# EAGLE design Slave (EAGLE 7.5.0)
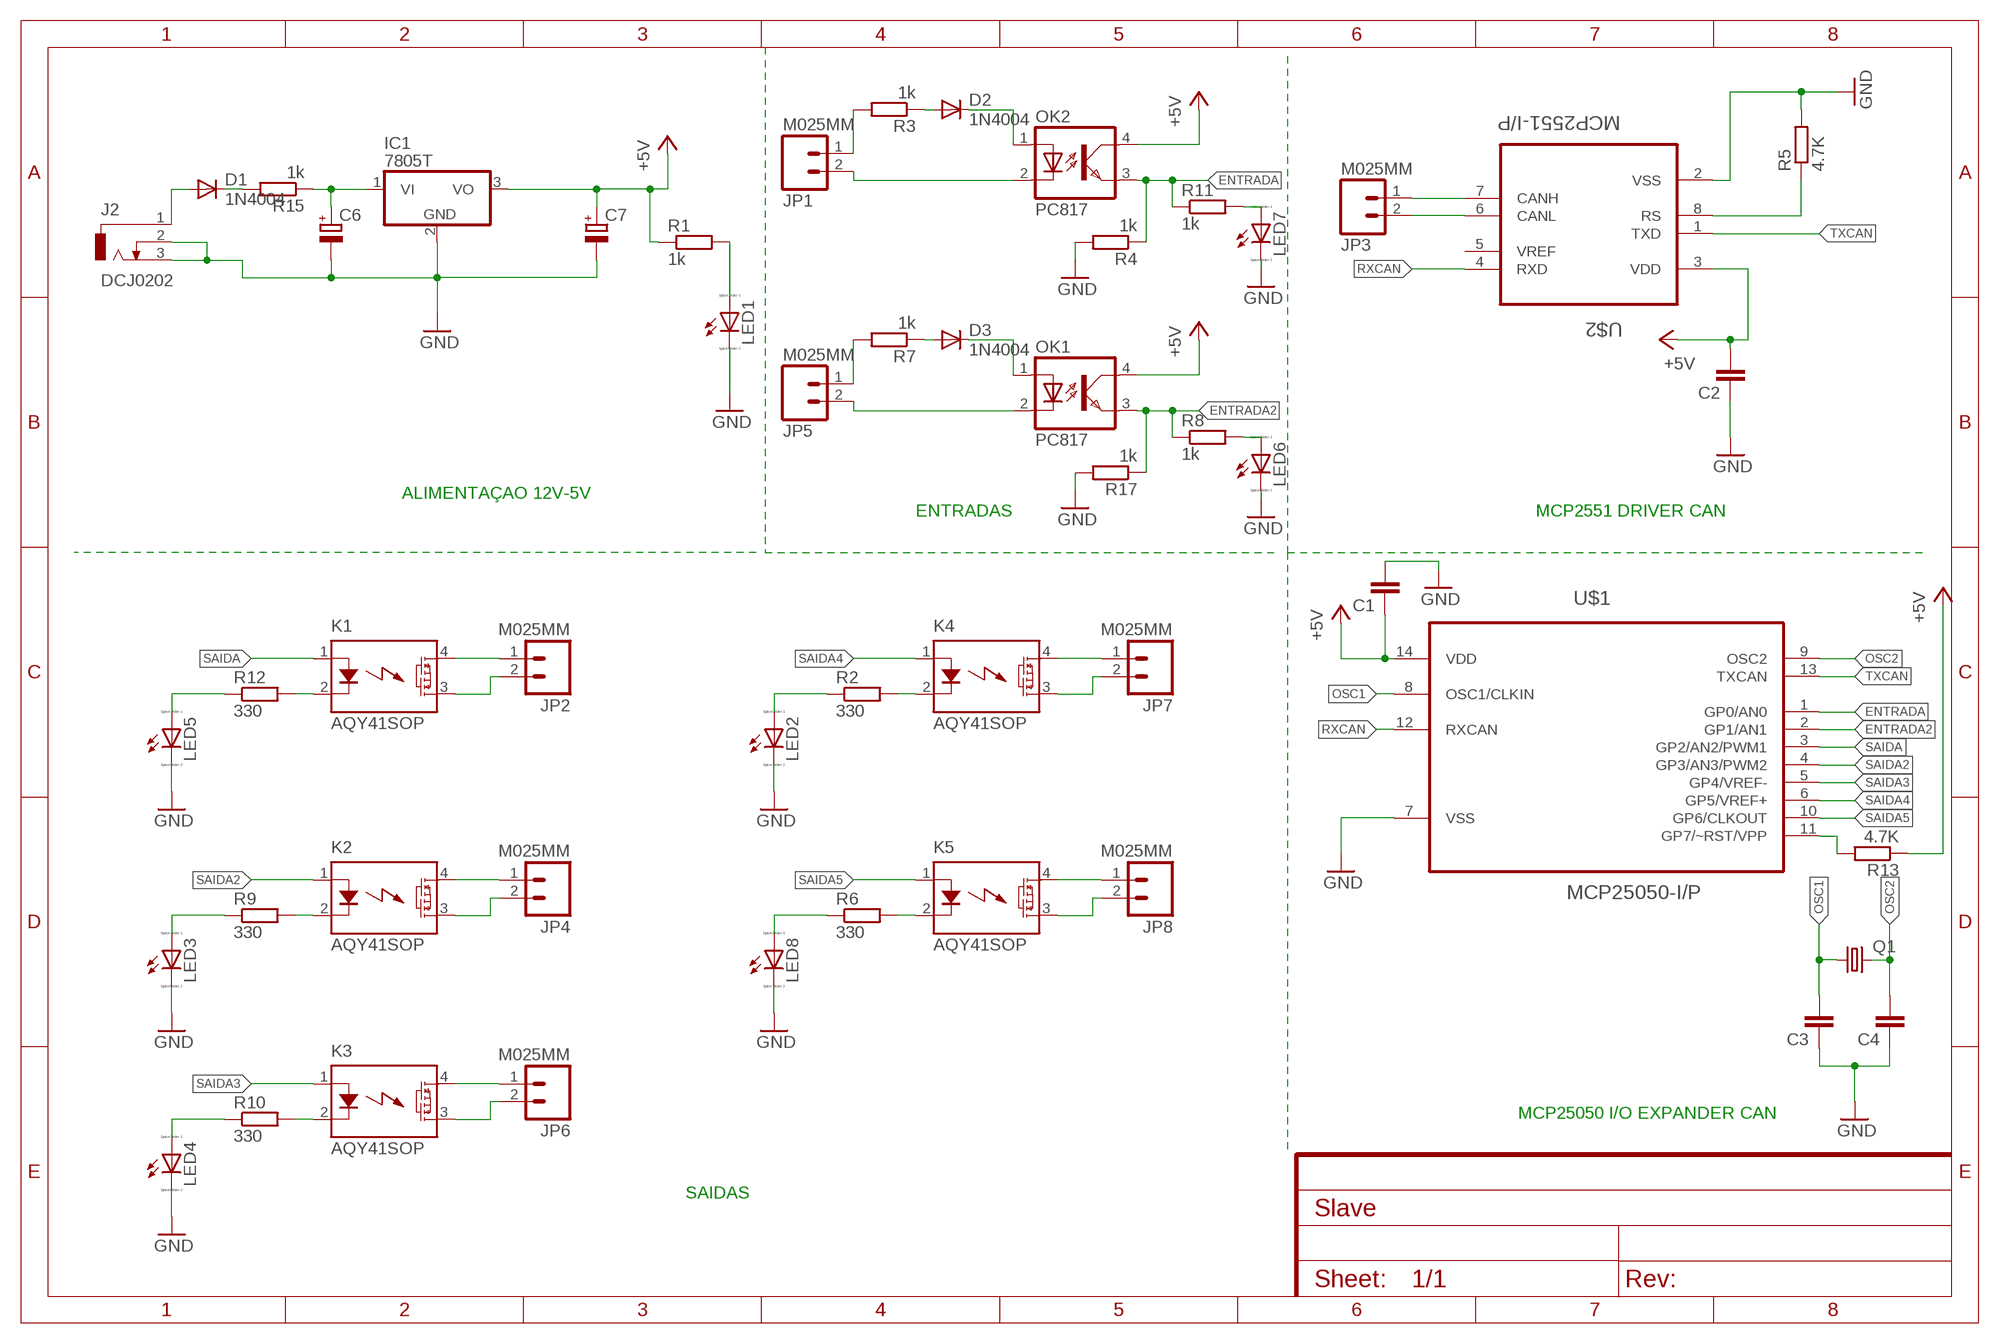
[diagram p0: schematic, sheet 1]

## Parts
C1  C-EU025-025X050  [C025-025X050]
C2  C-EU025-025X050  [C025-025X050]
C3  CAP_  [AXIAL-5MM]
C4  CAP_  [AXIAL-5MM]
C6  CPOL-EUE2.5-6  [E2,5-6]
C7  CPOL-EUE2.5-6  [E2,5-6]
D1  1N4004  [DO41-10]
D2  1N4004  [DO41-10]
D3  1N4004  [DO41-10]
IC1  7805T  [TO220H]
J2  DCJ0202  [DCJ0202]
JP1  M025MM  [SCREWTERMINAL-5MM-2]
JP2  M025MM  [SCREWTERMINAL-5MM-2]
JP3  M025MM  [SCREWTERMINAL-5MM-2]
JP4  M025MM  [SCREWTERMINAL-5MM-2]
JP5  M025MM  [SCREWTERMINAL-5MM-2]
JP6  M025MM  [SCREWTERMINAL-5MM-2]
JP7  M025MM  [SCREWTERMINAL-5MM-2]
JP8  M025MM  [SCREWTERMINAL-5MM-2]
K1  AQY41SOP  [SOP04]
K2  AQY41SOP  [SOP04]
K3  AQY41SOP  [SOP04]
K4  AQY41SOP  [SOP04]
K5  AQY41SOP  [SOP04]
LED1  LED_ELD260  [LED_LD260]
LED2  LED_ELD260  [LED_LD260]
LED3  LED_ELD260  [LED_LD260]
LED4  LED_ELD260  [LED_LD260]
LED5  LED_ELD260  [LED_LD260]
LED6  LED_ELD260  [LED_LD260]
LED7  LED_ELD260  [LED_LD260]
LED8  LED_ELD260  [LED_LD260]
OK1  PC817  [DIL04]
OK2  PC817  [DIL04]
Q1  CRYTALHC49S  [HC49/S]
R1  1k  R-EU_0204/7  [0204/7]
R2  330  R-EU_0204/7  [0204/7]
R3  1k  R-EU_0204/7  [0204/7]
R4  1k  R-EU_0204/7  [0204/7]
R5  4.7K  R-EU_0204/7  [0204/7]
R6  330  R-EU_0204/7  [0204/7]
R7  1k  R-EU_0204/7  [0204/7]
R8  1k  R-EU_0204/7  [0204/7]
R9  330  R-EU_0204/7  [0204/7]
R10  330  R-EU_0204/7  [0204/7]
R11  1k  R-EU_0204/7  [0204/7]
R12  330  R-EU_0204/7  [0204/7]
R13  4.7K  R-EU_0204/7  [0204/7]
R15  1k  R-EU_0204/7  [0204/7]
R17  1k  R-EU_0204/7  [0204/7]
U$1  MCP25050-I/P  [DIP254P762X432-14]
U$2  MCP2551-I/P  [DIP254P762X432-8]

## Nets
+5V: C1.1 C2.2 C7.+ IC1.3(VO) OK1.4(COL) OK2.4(COL) R1.1 R13.1 U$1.14(VDD) U$2.3(VDD)
ENTRADA: OK2.3(EMIT) R4.1 R11.1 U$1.1(GP0/AN0)
ENTRADA2: OK1.3(EMIT) R8.1 R17.1 U$1.2(GP1/AN1)
GND: C1.2 C2.1 C3.P$1 C4.P$1 C6.- C7.- IC1.2(GND) J2.2 J2.3 LED1.K(C) LED2.K(C) LED3.K(C) LED4.K(C) LED5.K(C) LED6.K(C) LED7.K(C) LED8.K(C) R4.2 R5.2 R17.2 U$1.7(VSS) U$2.2(VSS)
N$2: R5.1 U$2.8(RS)
N$3: JP2.2 K1.3(DS2)
N$4: JP2.1 K1.4(DS1)
N$5: K2.2(K) R9.2
N$6: JP1.1 R3.2
N$7: LED1.A R1.2
N$8: R13.2 U$1.11(GP7/~RST/VPP)
N$9: D2.A R3.1
N$10: D2.C OK2.1(A)
N$11: JP1.2 OK2.2(C)
N$13: D1.A J2.1
N$14: JP5.1 R7.2
N$15: D1.C R15.2
N$17: D3.A R7.1
N$18: D3.C OK1.1(A)
N$19: JP3.1 U$2.7(CANH)
N$20: LED3.A R9.1
N$21: JP4.2 K2.3(DS2)
N$22: JP4.1 K2.4(DS1)
N$23: K1.2(K) R12.2
N$24: LED5.A R12.1
N$25: K3.2(K) R10.2
N$26: LED4.A R10.1
N$27: JP6.2 K3.3(DS2)
N$28: JP6.1 K3.4(DS1)
N$29: C6.+ IC1.1(VI) R15.1
N$30: JP3.2 U$2.6(CANL)
N$31: LED6.A R8.2
N$32: LED7.A R11.2
N$33: K4.2(K) R2.2
N$34: JP5.2 OK1.2(C)
N$35: LED2.A R2.1
N$36: JP7.2 K4.3(DS2)
N$37: JP7.1 K4.4(DS1)
N$38: K5.2(K) R6.2
N$39: LED8.A R6.1
N$40: JP8.2 K5.3(DS2)
N$41: JP8.1 K5.4(DS1)
OSC1: C3.P$2 Q1.1 U$1.8(OSC1/CLKIN)
OSC2: C4.P$2 Q1.2 U$1.9(OSC2)
RXCAN: U$1.12(RXCAN) U$2.4(RXD)
SAIDA: K1.1(A) U$1.3(GP2/AN2/PWM1)
SAIDA2: K2.1(A) U$1.4(GP3/AN3/PWM2)
SAIDA3: K3.1(A) U$1.5(GP4/VREF-)
SAIDA4: K4.1(A) U$1.6(GP5/VREF+)
SAIDA5: K5.1(A) U$1.10(GP6/CLKOUT)
TXCAN: U$1.13(TXCAN) U$2.1(TXD)
Unconnected: U$2.5(VREF)

## Notes on the sheet
- ALIMENTAÇAO 12V-5V
- ENTRADAS | MCP2551 DRIVER CAN
- MCP25050 I/O EXPANDER CAN
- SAIDAS

## Library data of the parts
C1 C2 = rcl:C-EU: CAPACITOR, European symbol
C3 C4 = SparkFun-Capacitors:CAP: Capacitor Standard 0603 ceramic capacitor, and 0.1" leaded capacitor.
C6 C7 = resistor:CPOL-EU: POLARIZED CAPACITOR, European symbol
D1-D3 = adafruit:1N4004: DIODE General purpose 1N400x type rectifier (With bigger pads) http://www.ladyada.net/library/pcb/eaglelibrary.html
IC1 = linear:78*: Positive VOLTAGE REGULATOR Source: http://cache.national.com/ds/LM/LM78L05.pdf http://www.fairchildsemi.com/ds/LM/LM7805.pdf
J2 = con-jack:DCJ0202: DC POWER JACK Source: DCJ0202.pdf; OC_FARNELL: unknown; OC_NEWARK: unknown
JP1-JP8 = SparkFun-Connectors:M02: Standard 2-pin 0.1" header. Use with - straight break away headers ( PRT-00116) - right angle break away headers (PRT-00553) - swiss pins (PRT-00743) - machine pins (PRT-00117) - female headers (PRT-00115) Molex polarized connector foot print use with: PRT-08233 with associated crimp pins and housings. 2.54_SCREWTERM for use with PRT-10571. 3.5mm Screw Terminal footprints for PRT-08084 5mm Screw Terminal footprints for use with PRT-08433
K1-K5 = relay:AQY*: PhotoMOS Relay NAiS Source: http://www.panasonic-electric-works.com/catalogues/downloads/photomos/ds_x615_en_aqz10_20.pdf; OC_FARNELL: unknown; OC_NEWARK: unknown
LED1-LED8 = eagle-ltspice:LED_E: LED Source: http://www.osram.convergy.de Source: www.luxeon.com Source: www.kingbright.com; SPICEMODEL: NONE; SPICEPREFIX: D; SPICETYPE: diode
OK1 OK2 = optocoupler:PC817: SHARP OPTO COUPLER; MPN: PC817X4J000F; OC_FARNELL: 9707727; OC_NEWARK: 97K7059
Q1 = crystal:CRYTAL: CRYSTAL
R1-R13 R15 R17 = resistor:R-EU_: RESISTOR, European symbol
U$1 = Microchip_By_element14_Batch_1:MCP25050-I/P: CAN I/O Expander Family; MPN: MCP25050-I/P; OC_FARNELL: 1439736; OC_NEWARK: 59K0224; PACKAGE: DIP-14; SUPPLIER: Microchip
U$2 = Microchip_By_element14_Batch_1:MCP2551-I/P: High-Speed CAN Transceiver; DESCRIPTION: CAN CTRL; MPN: MCP2551-I/P; OC_FARNELL: 1292240; OC_NEWARK: 61K2947; PACKAGE: PDIP-8; SUPPLIER: Microchip

## Board
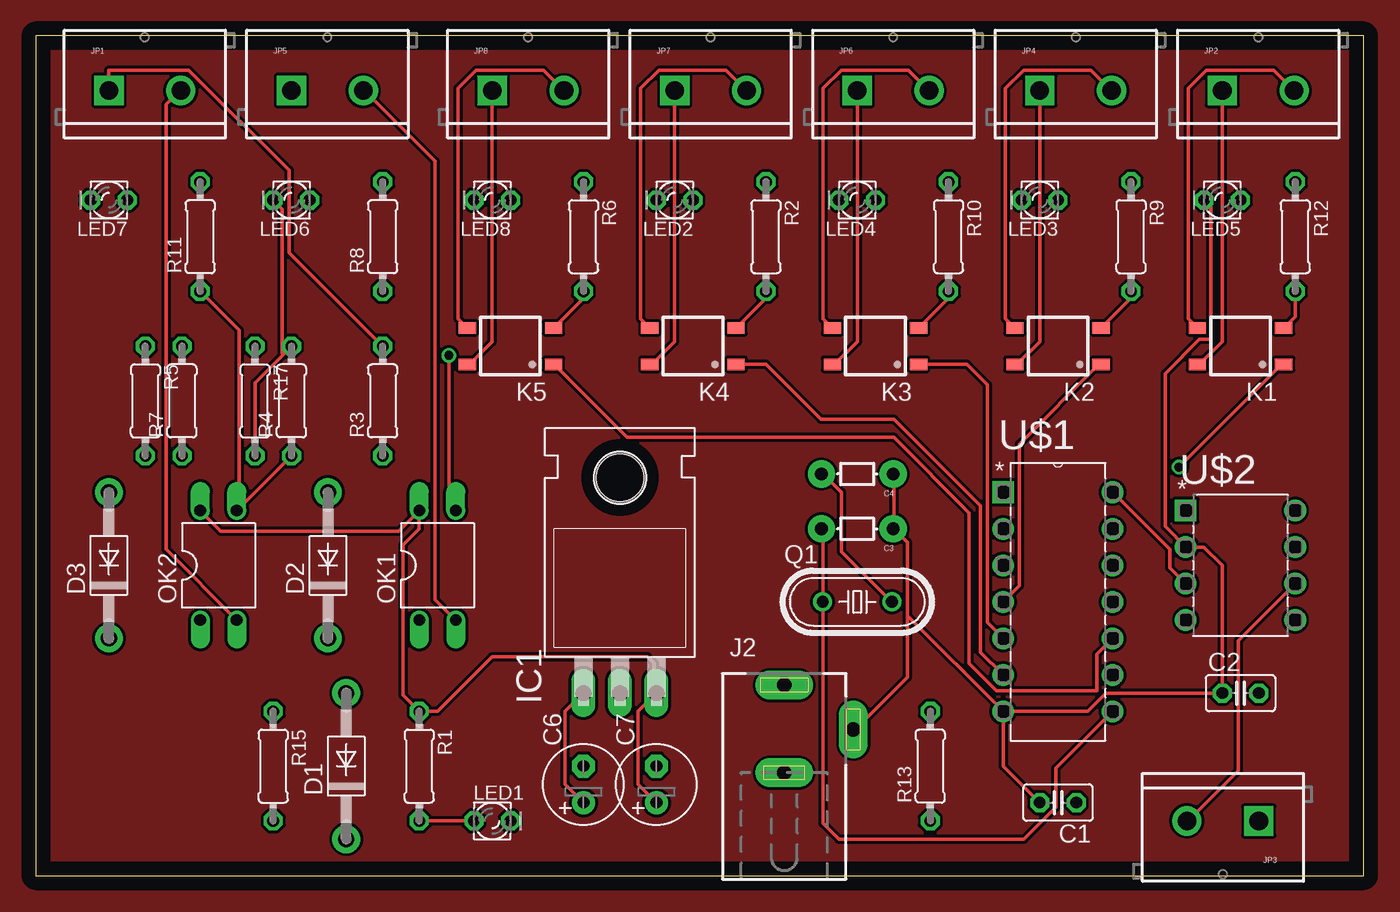
[diagram p1: board, top side]
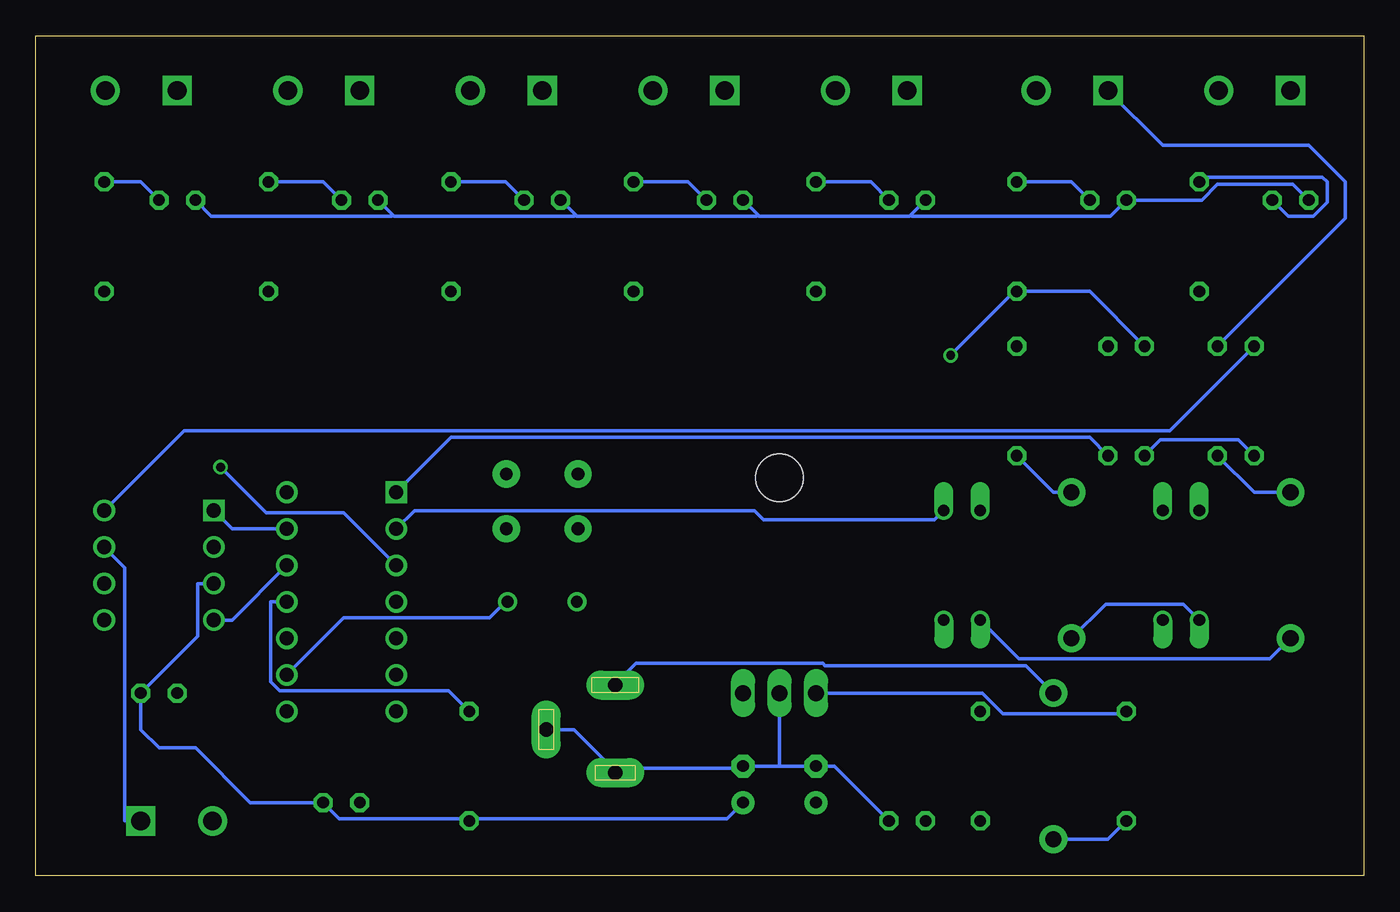
[diagram p2: board, bottom side, seen from below]

Size 92.38 x 58.41 mm. Coordinates in mm from the lower left corner, seen from the top.
Outline: 0,0 92.38,0 92.38,58.41 0,58.41 0,0
Copper layers (1*16): Top 0.035mm / dielectric 1.5mm / Bottom 0.035mm
Design rules "default": minimum track width 10mil, minimum drill 24mil, track to track 8mil, track to pad 8mil, pad to pad 8mil, via to via 8mil, smd to smd 8mil, copper to edge 40mil, drill to drill 8mil, minimum pad ring 10mil, minimum via ring 8mil, stop-mask expansion 4mil, vias tented up to drill 0mil, thermal gap 10mil

### Footprints (pad centres in the part's own frame; a part is rotated, then mirrored left to right if it is on the bottom)
C025-025X050 = drill 0.813 octagon: 1 -1.27,0; 2 1.27,0
AXIAL-5MM = drill 0.9 pad 1.88: P$1 -2.5,0; P$2 2.5,0
E2,5-6 = drill 0.813 pad 1.6: + -1.27,0 | drill 0.813 pad 1.6 octagon: - 1.27,0
DO41-10 = drill 1.118 pad 1.93: A 5.08,0; C -5.08,0
TO220H = drill 1.118 long: 1 -2.54,-10.16; 2 0,-10.16; 3 2.54,-10.16 | hole 3.302: 0,4.826
DCJ0202 = drill 1 pad 2 long: 1 0,3.1; 2 4.8,0; 3 0,-3
SCREWTERMINAL-5MM-2 = drill 1.3 pad 2.032 square: 1 0,0 | drill 1.3 pad 2.032: 2 5,0
SOP04 = smd 0.8 x 1.2: 1 -1.27,-3; 2 1.27,-3; 3 1.27,3; 4 -1.27,3
LED_LD260 = drill 0.813 octagon: A -1.27,0; K 1.27,0
DIL04 = drill 0.813 offset: 1 -1.27,-3.81; 2 1.27,-3.81; 3 1.27,3.81; 4 -1.27,3.81
HC49/S = drill 0.813: 1 -2.413,0; 2 2.413,0
0204/7 = drill 0.813 octagon: 1 -3.81,0; 2 3.81,0
DIP254P762X432-14 = drill 0.991 square: 1 -7.62,15.24 | drill 0.991: 2 -7.62,12.7; 3 -7.62,10.16; 4 -7.62,7.62; 5 -7.62,5.08; 6 -7.62,2.54; 7 -7.62,0; 8 0,0; 9 0,2.54; 10 0,5.08; 11 0,7.62; 12 0,10.16; 13 0,12.7; 14 0,15.24
DIP254P762X432-8 = drill 0.991 square: 1 -7.62,7.62 | drill 0.991: 2 -7.62,5.08; 3 -7.62,2.54; 4 -7.62,0; 5 0,0; 6 0,2.54; 7 0,5.08; 8 0,7.62

### Placement (x,y rotation side)
C1  71.12,5.08 180 top
C2  83.82,12.7 0 top
C3  57.15,24.13 180 top
C4  57.15,27.94 180 top
C6  38.1,6.35 90 top
C7  43.18,6.35 90 top
D1  21.59,7.62 90 top
D2  20.32,21.59 90 top
D3  5.08,21.59 90 top
IC1  40.64,22.86 0 top
J2  52.07,10.16 0 top
JP1  5.08,54.61 0 top
JP2  82.55,54.61 0 top
JP3  85.09,3.81 180 top
JP4  69.85,54.61 0 top
JP5  17.78,54.61 0 top
JP6  57.15,54.61 0 top
JP7  44.45,54.61 0 top
JP8  31.75,54.61 0 top
K1  83.82,36.83 90 top
K2  71.12,36.83 90 top
K3  58.42,36.83 90 top
K4  45.72,36.83 90 top
K5  33.02,36.83 90 top
LED1  31.75,3.81 0 top
LED2  44.45,46.99 180 top
LED3  69.85,46.99 180 top
LED4  57.15,46.99 180 top
LED5  82.55,46.99 180 top
LED6  17.78,46.99 180 top
LED7  5.08,46.99 180 top
LED8  31.75,46.99 180 top
OK1  27.94,21.59 0 top
OK2  12.7,21.59 0 top
Q1  57.15,19.05 0 top
R1  26.67,7.62 270 top
R2  50.8,44.45 270 top
R3  24.13,33.02 90 top
R4  17.78,33.02 90 top
R5  7.62,33.02 270 top
R6  38.1,44.45 270 top
R7  10.16,33.02 90 top
R8  24.13,44.45 90 top
R9  76.2,44.45 270 top
R10  63.5,44.45 270 top
R11  11.43,44.45 90 top
R12  87.63,44.45 270 top
R13  62.23,7.62 90 top
R15  16.51,7.62 270 top
R17  15.24,33.02 270 top
U$1  74.93,11.43 0 top
U$2  87.63,17.78 0 top

### Tracks (layer width: path | path; a pad name or v marks a point on that pad's centre or on a via)
+5V
  Top 0.254: OK2.4 12.86,23.97 25.24,23.97 OK1.4 26.67,24.13 25.56,23.02 25.56,12.54 R1.1 27.94,11.43 31.75,15.24 42.55,15.24 43.02,14.76 43.02,12.7 IC1.3 41.91,11.43 41.91,6.35 C7.+ | U$1.14 78.9,22.7 78.9,21.43 U$2.3
  Bottom 0.254: U$2.3 81.12,20.32 81.12,16.67 C2.2 85.09,10.16 83.82,8.89 81.28,8.89 77.47,5.08 C1.1 71.28,3.97 62.39,3.97 R13.1 62.23,3.97 44.29,3.97 C7.+
ENTRADA
  Top 0.254: R4.1 OK2.3 14.13,25.72 14.13,37.94 R11.1
  Bottom 0.254: U$1.1 63.5,30.48 19.05,30.48 R4.1
ENTRADA2  (via drill 0.61)
  Top 0.254: OK1.3 28.73,25.88 v28.73,36.2
  Bottom 0.254: v28.73,36.2 24.29,40.64 R8.1 19.05,40.64 R17.1 | U$1.2 66.04,25.4 42.39,25.4 41.75,24.77 29.84,24.77 OK1.3
GND
  Top 0.254: 59.69,24.13 59.69,27.94 C4.P$1 | 59.69,24.13 60.64,23.18 60.64,18.1 | 60.64,18.1 60.64,13.81 56.99,10.16 J2.2 | 59.69,24.13 C3.P$1 | 60.64,18.1 U$1.7 | 17.22,36.27 15.24,34.29 R17.2 | 17.22,36.27 R4.2 | LED6.K 17.14,46.36 17.14,36.35 17.22,36.27 | LED5.K 81.76,46.51 81.76,37.31 80.96,37.31 78.58,34.93 78.58,24.29 U$2.2 81.28,22.86 82.55,21.59 C2.1 74.45,12.7 73.18,11.43 U$1.7 | U$1.7 67.31,7.62 C1.2
  Bottom 0.254: 40.64,7.62 C7.- 43.34,7.46 52.07,7.46 J2.3 52.07,7.3 54.93,10.16 J2.2 | 40.64,7.62 IC1.2 | LED7.K 4.92,48.1 10.16,48.1 11.27,46.99 LED6.K 17.62,45.88 31.43,45.88 31.51,45.96 | R5.2 8.73,30.32 14.13,30.32 R17.2 | 31.51,45.96 31.59,45.88 42.07,45.88 42.15,45.96 | 31.51,45.96 LED8.K | LED2.K 42.15,45.96 | 54.85,45.96 54.77,45.88 42.23,45.88 42.15,45.96 | 54.85,45.96 LED4.K | 67.55,45.96 67.47,45.88 54.93,45.88 54.85,45.96 | 67.55,45.96 LED3.K | LED5.K 80.17,45.88 67.63,45.88 67.55,45.96 | LED1.K 36.83,7.62 C6.- 40.64,7.62
N$1
  pour Top: -2.54,63.5 99.06,63.5 99.06,-3.81 -7.62,-3.81 -7.62,63.5
N$2
  Bottom 0.254: R5.1 13.49,30.96 82.07,30.96 U$2.8
N$3
  Top 0.254: K1.3 80.8,38.1 80.17,38.73 80.17,54.77 81.44,56.04 86.12,56.04 JP2.2 87.47,54.61
N$4
  Top 0.254: JP2.1 82.55,37.15 80.96,35.56 K1.4
N$5
  Top 0.254: R9.2 76.2,40.16 74.14,38.1 K2.2
N$6
  Top 0.254: R3.2 17.62,43.34 17.62,49.05 10.64,56.04 5.08,56.04 JP1.1
N$7
  Top 0.254: LED1.A R1.2
N$8
  Bottom 0.254: R13.2 63.66,12.86 75.41,12.86 76.04,13.49 76.04,19.05 U$1.11
N$9
  Bottom 0.254: R3.1 21.59,26.67 D2.A
N$10
  Bottom 0.254: OK2.1 12.54,18.89 17.94,18.89 D2.C
N$11
  Top 0.254: OK2.2 9.05,22.7 9.05,53.66 10,54.61 JP1.2
N$13
  Bottom 0.254: D1.A 23.5,14.6 37.47,14.6 37.62,14.76 50.64,14.76 52.07,13.33 J2.1
N$14
  Bottom 0.254: JP5.1 13.97,50.8 3.81,50.8 1.27,48.26 1.27,45.72 R7.2
N$15
  Bottom 0.254: R15.2 17.78,2.54 D1.C
N$17
  Bottom 0.254: R7.1 7.62,26.67 D3.A
N$18
  Bottom 0.254: OK1.1 23.97,15.08 6.51,15.08 D3.C
N$19
  Bottom 0.254: U$2.7 86.2,21.43 86.2,3.81 JP3.1
N$20
  Bottom 0.254: LED3.A 72.39,48.26 R9.1
N$21
  Top 0.254: K2.3 68.1,38.1 67.47,38.73 67.47,54.77 68.74,56.04 73.42,56.04 JP4.2 74.77,54.61
N$22
  Top 0.254: JP4.1 69.85,37.15 68.26,35.56 K2.4
N$23
  Top 0.254: R12.2 87.63,38.89 86.84,38.1 K1.2
N$24
  Bottom 0.254: LED5.A 85.09,48.26 R12.1
N$25
  Top 0.254: R10.2 63.5,40.16 61.44,38.1 K3.2
N$26
  Bottom 0.254: LED4.A 59.69,48.26 R10.1
N$27
  Top 0.254: K3.3 55.4,38.1 54.77,38.73 54.77,54.77 56.04,56.04 60.72,56.04 JP6.2 62.07,54.61
N$28
  Top 0.254: JP6.1 57.15,37.15 55.56,35.56 K3.4
N$29
  Top 0.254: C6.+ 36.83,6.35 36.83,11.43 IC1.1
  Bottom 0.254: R15.1 16.67,11.27 25.08,11.27 26.51,12.7 IC1.1
N$30
  Top 0.254: U$2.6 83.66,16.35 83.66,7.3 80.17,3.81 JP3.2
N$31
  Bottom 0.254: LED6.A 20.32,48.26 R8.2
N$32
  Bottom 0.254: LED7.A 5.24,45.88 3.49,45.88 2.54,46.83 2.54,48.26 2.86,48.58 11.11,48.58 R11.2
N$33
  Top 0.254: R2.2 50.8,40.16 48.74,38.1 K4.2
N$34
  Top 0.254: OK1.2 27.78,19.21 27.78,49.69 22.86,54.61 JP5.2
N$35
  Bottom 0.254: LED2.A 46.99,48.26 R2.1
N$36
  Top 0.254: K4.3 42.7,38.1 42.07,38.73 42.07,54.77 43.34,56.04 48.02,56.04 JP7.2 49.37,54.61
N$37
  Top 0.254: JP7.1 44.45,37.15 42.86,35.56 K4.4
N$38
  Top 0.254: R6.2 38.1,40.16 36.04,38.1 K5.2
N$39
  Bottom 0.254: LED8.A 34.29,48.26 R6.1
N$40
  Top 0.254: K5.3 30,38.1 29.37,38.73 29.37,54.77 30.64,56.04 35.32,56.04 JP8.2 36.67,54.61
N$41
  Top 0.254: JP8.1 31.75,37.15 30.16,35.56 K5.4
OSC1
  Top 0.254: 54.77,19.05 54.77,24.13 C3.P$2 | U$1.8 70.96,7.46 70.96,4.76 68.74,2.54 55.88,2.54 54.77,3.65 54.77,19.05 | 54.77,19.05 Q1.1
OSC2
  Top 0.254: Q1.2 59.53,19.05 56.04,22.54 56.04,26.67 54.77,27.94 C4.P$2
  Bottom 0.254: U$1.9 70.96,17.94 60.8,17.94 59.69,19.05 Q1.2
RXCAN
  Bottom 0.254: U$1.12 78.74,17.78 U$2.4
SAIDA  (via drill 0.61)
  Top 0.254: v79.53,28.42 86.68,35.56 K1.1
  Bottom 0.254: v79.53,28.42 76.36,25.24 70.96,25.24 U$1.3
SAIDA2
  Top 0.254: U$1.4 68.42,20.16 68.42,30 73.98,35.56 K2.1
SAIDA3
  Top 0.254: U$1.5 66.2,17.62 66.2,34.13 64.77,35.56 K3.1 61.44,35.56
SAIDA4
  Top 0.254: U$1.6 65.72,15.56 65.72,25.72 59.69,31.75 54.61,31.75 50.8,35.56 K4.1 48.74,35.56
SAIDA5
  Top 0.254: U$1.10 73.82,15.4 73.82,12.86 66.83,12.86 64.93,14.76 64.93,25.24 59.69,30.48 41.12,30.48 36.04,35.56 K5.1
TXCAN
  Bottom 0.254: U$2.1 78.74,24.13 U$1.13